# EAGLE design INPUTBRD (EAGLE 5.07)
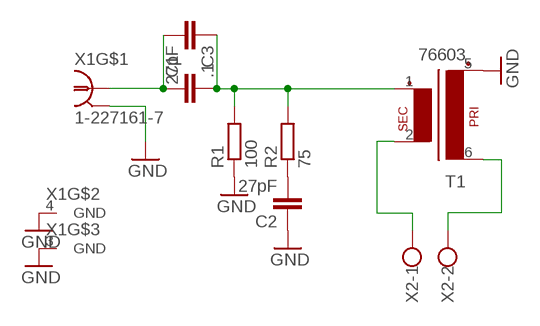
[diagram p0: schematic, sheet 1]

## Parts
C1  .1  C-EU150-072X183  [C150-072X183]
C2  27pF  C-EU050-035X075  [C050-035X075]
C3  27pF  C-EUC1210  [C1210]
R1  100  R-EU_0207/10  [0207/10]
R2  75  R-EU_0207/10  [0207/10]
T1  76603  [766-4]
X1  1-227161-7  [AMP_227161]
X2  W237-02P  [W237-132]

## Nets
GND: C2.1 R1.1 T1.5(P1) X1.2(GND) X1.3(GND) X1.4(GND)
N$1: C1.1 C3.2 X1.1
N$2: C1.2 C3.1 R1.2 R2.2 T1.1(S1)
N$3: C2.2 R2.1
N$4: T1.2(S2) X2.1
N$5: T1.6(P2) X2.2

## Library data of the parts
C1-C3 = resistor:C-EU: CAPACITOR, European symbol
R1 R2 = resistor:R-EU_: RESISTOR, European symbol
T1 = pulse:76603
X1 = con-coax:?227161*: JACK, RIGHT ANGLE, 50 OHM, PCB, BNC Source: amp_227161.pdf
X2 = con-wago-508:W237-02P: WAGO SREW CLAMP

## Board
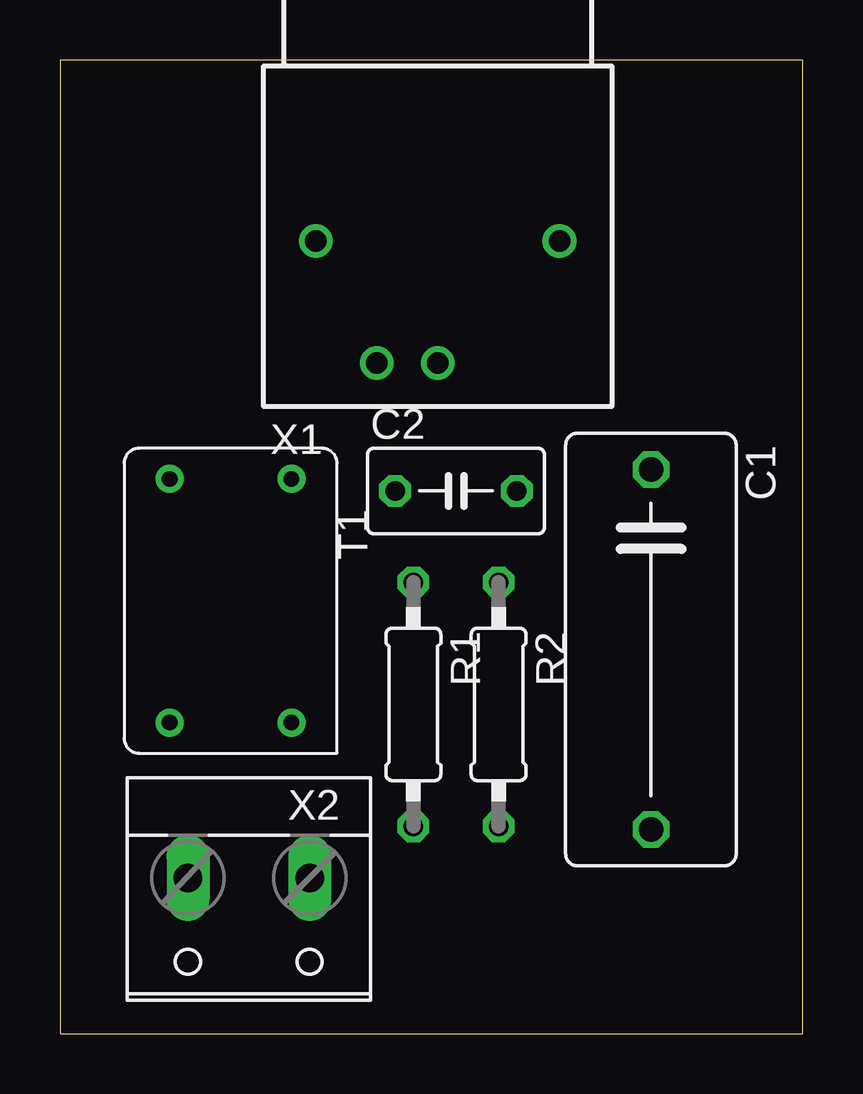
[diagram p1: board, top side]
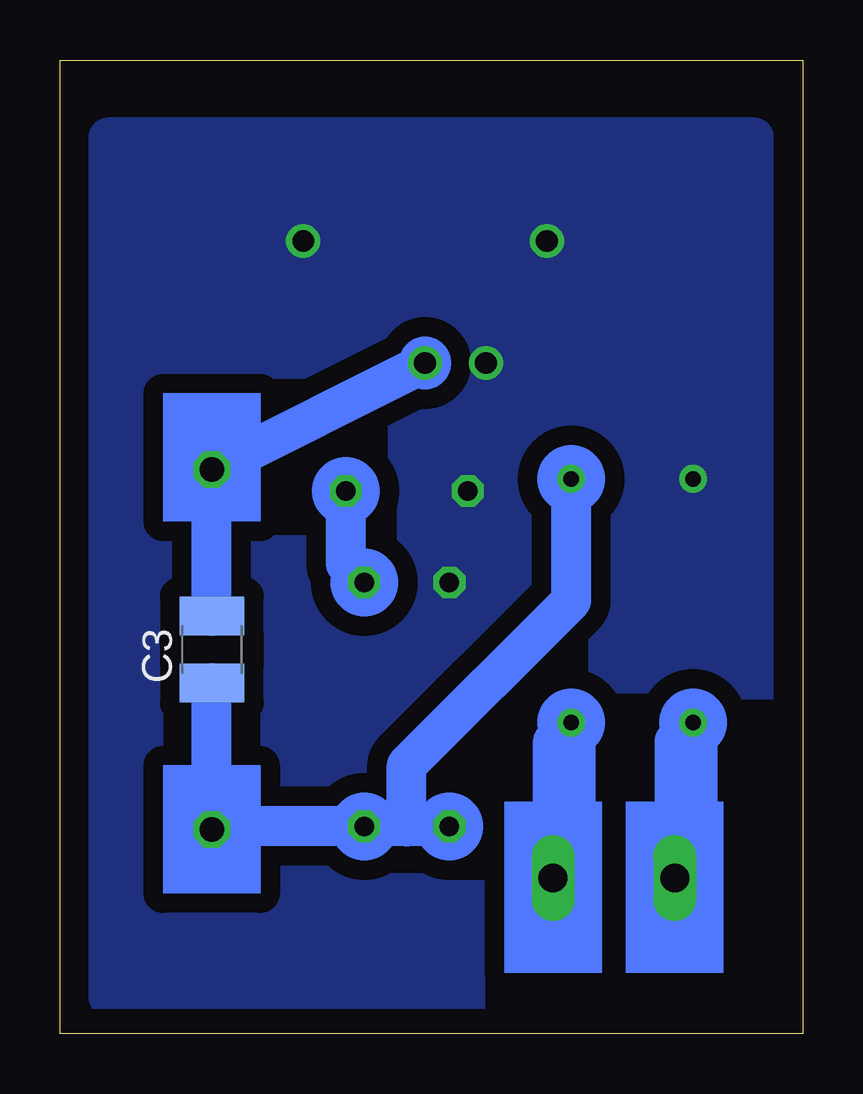
[diagram p2: board, bottom side, seen from below]

Size 30.97 x 40.56 mm. Coordinates in mm from the lower left corner, seen from the top.
Outline: 0,0 30.97,0 30.97,40.56 0,40.56 0,0
Copper layers (1*16): Top 0.035mm / dielectric 1.5mm / Bottom 0.035mm
Design rules "default": minimum track width 10mil, minimum drill 24mil, track to track 8mil, track to pad 8mil, pad to pad 8mil, via to via 8mil, smd to smd 8mil, copper to edge 40mil, drill to drill 8mil, minimum pad ring 10mil, minimum via ring 8mil, stop-mask expansion 4mil, vias tented up to drill 0mil, thermal gap 10mil

### Footprints (pad centres in the part's own frame; a part is rotated, then mirrored left to right if it is on the bottom)
C150-072X183 = drill 1.016 octagon: 1 -7.493,0; 2 7.493,0
C050-035X075 = drill 0.813 octagon: 1 -2.54,0; 2 2.54,0
C1210 = smd 1.6 x 2.7: 1 -1.4,0; 2 1.4,0
0207/10 = drill 0.813 octagon: 1 -5.08,0; 2 5.08,0
766-4 = drill 0.65 round: 1 -5.08,2.54; 2 5.08,2.54; 5 -5.08,-2.54; 6 5.08,-2.54
AMP_227161 = drill 0.9 pad 1.27 round: 1 0,-5.08; 2 -2.54,-5.08; 3 -5.08,0; 4 5.08,0
W237-132 = drill 1.194 long: 1 -2.54,-0.635; 2 2.54,-0.635

### Placement (x,y rotation side)
C1  24.64,16 270 top
C2  16.51,22.61 0 top
C3  24.64,16 90 bottom
R1  14.73,13.72 270 top
R2  18.29,13.72 270 top
T1  7.11,18.03 270 top
X1  15.75,33.02 0 top
X2  7.87,5.84 180 top

### Tracks (layer width: path | path; a pad name or v marks a point on that pad's centre or on a via)
GND
  pour Bottom (isolate 0.813, no thermals): 28.96,1.52 2.03,1.52 2.03,37.34 28.96,37.34
N$1
  Bottom 1.676: X1.1 C1.1 C3.2
N$2
  Bottom 1.676: T1.1 9.65,18.03 16.51,11.18 16.51,8.64 | R1.2 16.51,8.64 | 16.51,8.64 R2.2 24.51,8.64 C1.2 C3.1
N$3
  Bottom 1.676: R2.1 19.05,19.56 C2.2
N$4
  Bottom 1.676: T1.2 10.41,12.19 X2.1
N$5
  Bottom 1.676: X2.2 5.33,12.19 T1.6
(copper drawn outside any net)
  shapes: Bottom area x7, Bottom circle x8